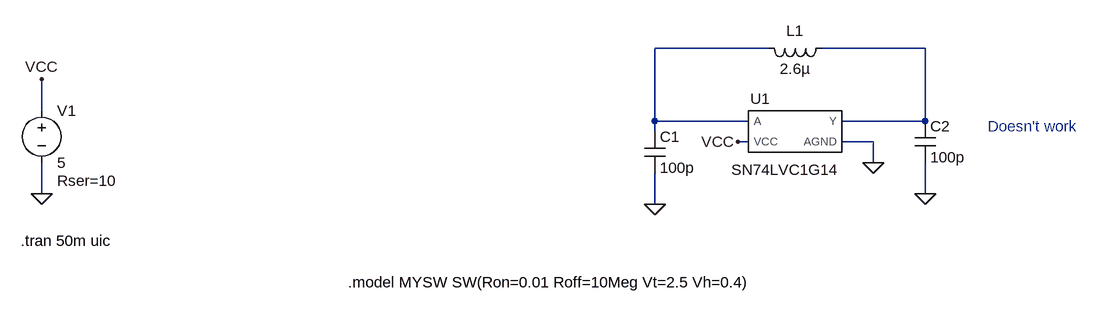
[diagram p0: schematic L_R_oscillator.asc]
L_R_oscillator.asc, the LTspice schematic file:
Version 4
SHEET 1 1420 680
WIRE 656 16 480 16
WIRE 896 16 736 16
WIRE -464 112 -464 64
WIRE 480 128 480 16
WIRE 624 128 480 128
WIRE 896 128 896 16
WIRE 896 128 768 128
WIRE 480 144 480 128
WIRE 624 160 608 160
WIRE 816 160 768 160
WIRE 816 192 816 160
WIRE -464 240 -464 192
WIRE 896 240 896 192
WIRE 480 256 480 208
FLAG -464 240 0
FLAG -464 64 VCC
FLAG 608 160 VCC
FLAG 480 256 0
FLAG 816 192 0
FLAG 896 240 0
SYMBOL voltage -464 96 R0
WINDOW 123 0 0 Left 0
WINDOW 39 24 124 Left 2
SYMATTR SpiceLine Rser=10
SYMATTR InstName V1
SYMATTR Value 5
SYMBOL AutoGenerated\\SN74LVC1G14 672 144 R0
WINDOW 0 -30 -35 Bottom 2
SYMATTR InstName U1
SYMBOL ind 752 0 R90
WINDOW 0 5 56 VBottom 2
WINDOW 3 32 56 VTop 2
SYMATTR InstName L1
SYMATTR Value 2.6µ
SYMATTR SpiceLine Rser=0.1
SYMBOL cap 464 144 R0
SYMATTR InstName C1
SYMATTR Value 100p
SYMBOL cap 880 128 R0
SYMATTR InstName C2
SYMATTR Value 100p
TEXT -496 312 Left 2 !.tran 50m uic
TEXT 8 376 Left 2 !.model MYSW SW(Ron=0.01 Roff=10Meg Vt=2.5 Vh=0.4)
TEXT 992 136 Left 2 ;Doesn't work

The netlist it stands for:
* L_R_oscillator.asc
V1 VCC 0 5 Rser=10
XU1 N002 N001 VCC 0 SN74LVC1G14  ; pins Y A VCC AGND
L1 N002 N001 2.6µ Rser=0.1
C1 N001 0 100p
C2 N002 0 100p
.tran 50m uic
.model MYSW SW(Ron=0.01 Roff=10Meg Vt=2.5 Vh=0.4)
* Doesn't work
.lib SN74LVC1G14.cir
.backanno
.end